# Altium schematic sheet Sheet4.SchDoc
size A3; DocumentNumber: 4; SheetNumber: 4; SheetTotal: 6
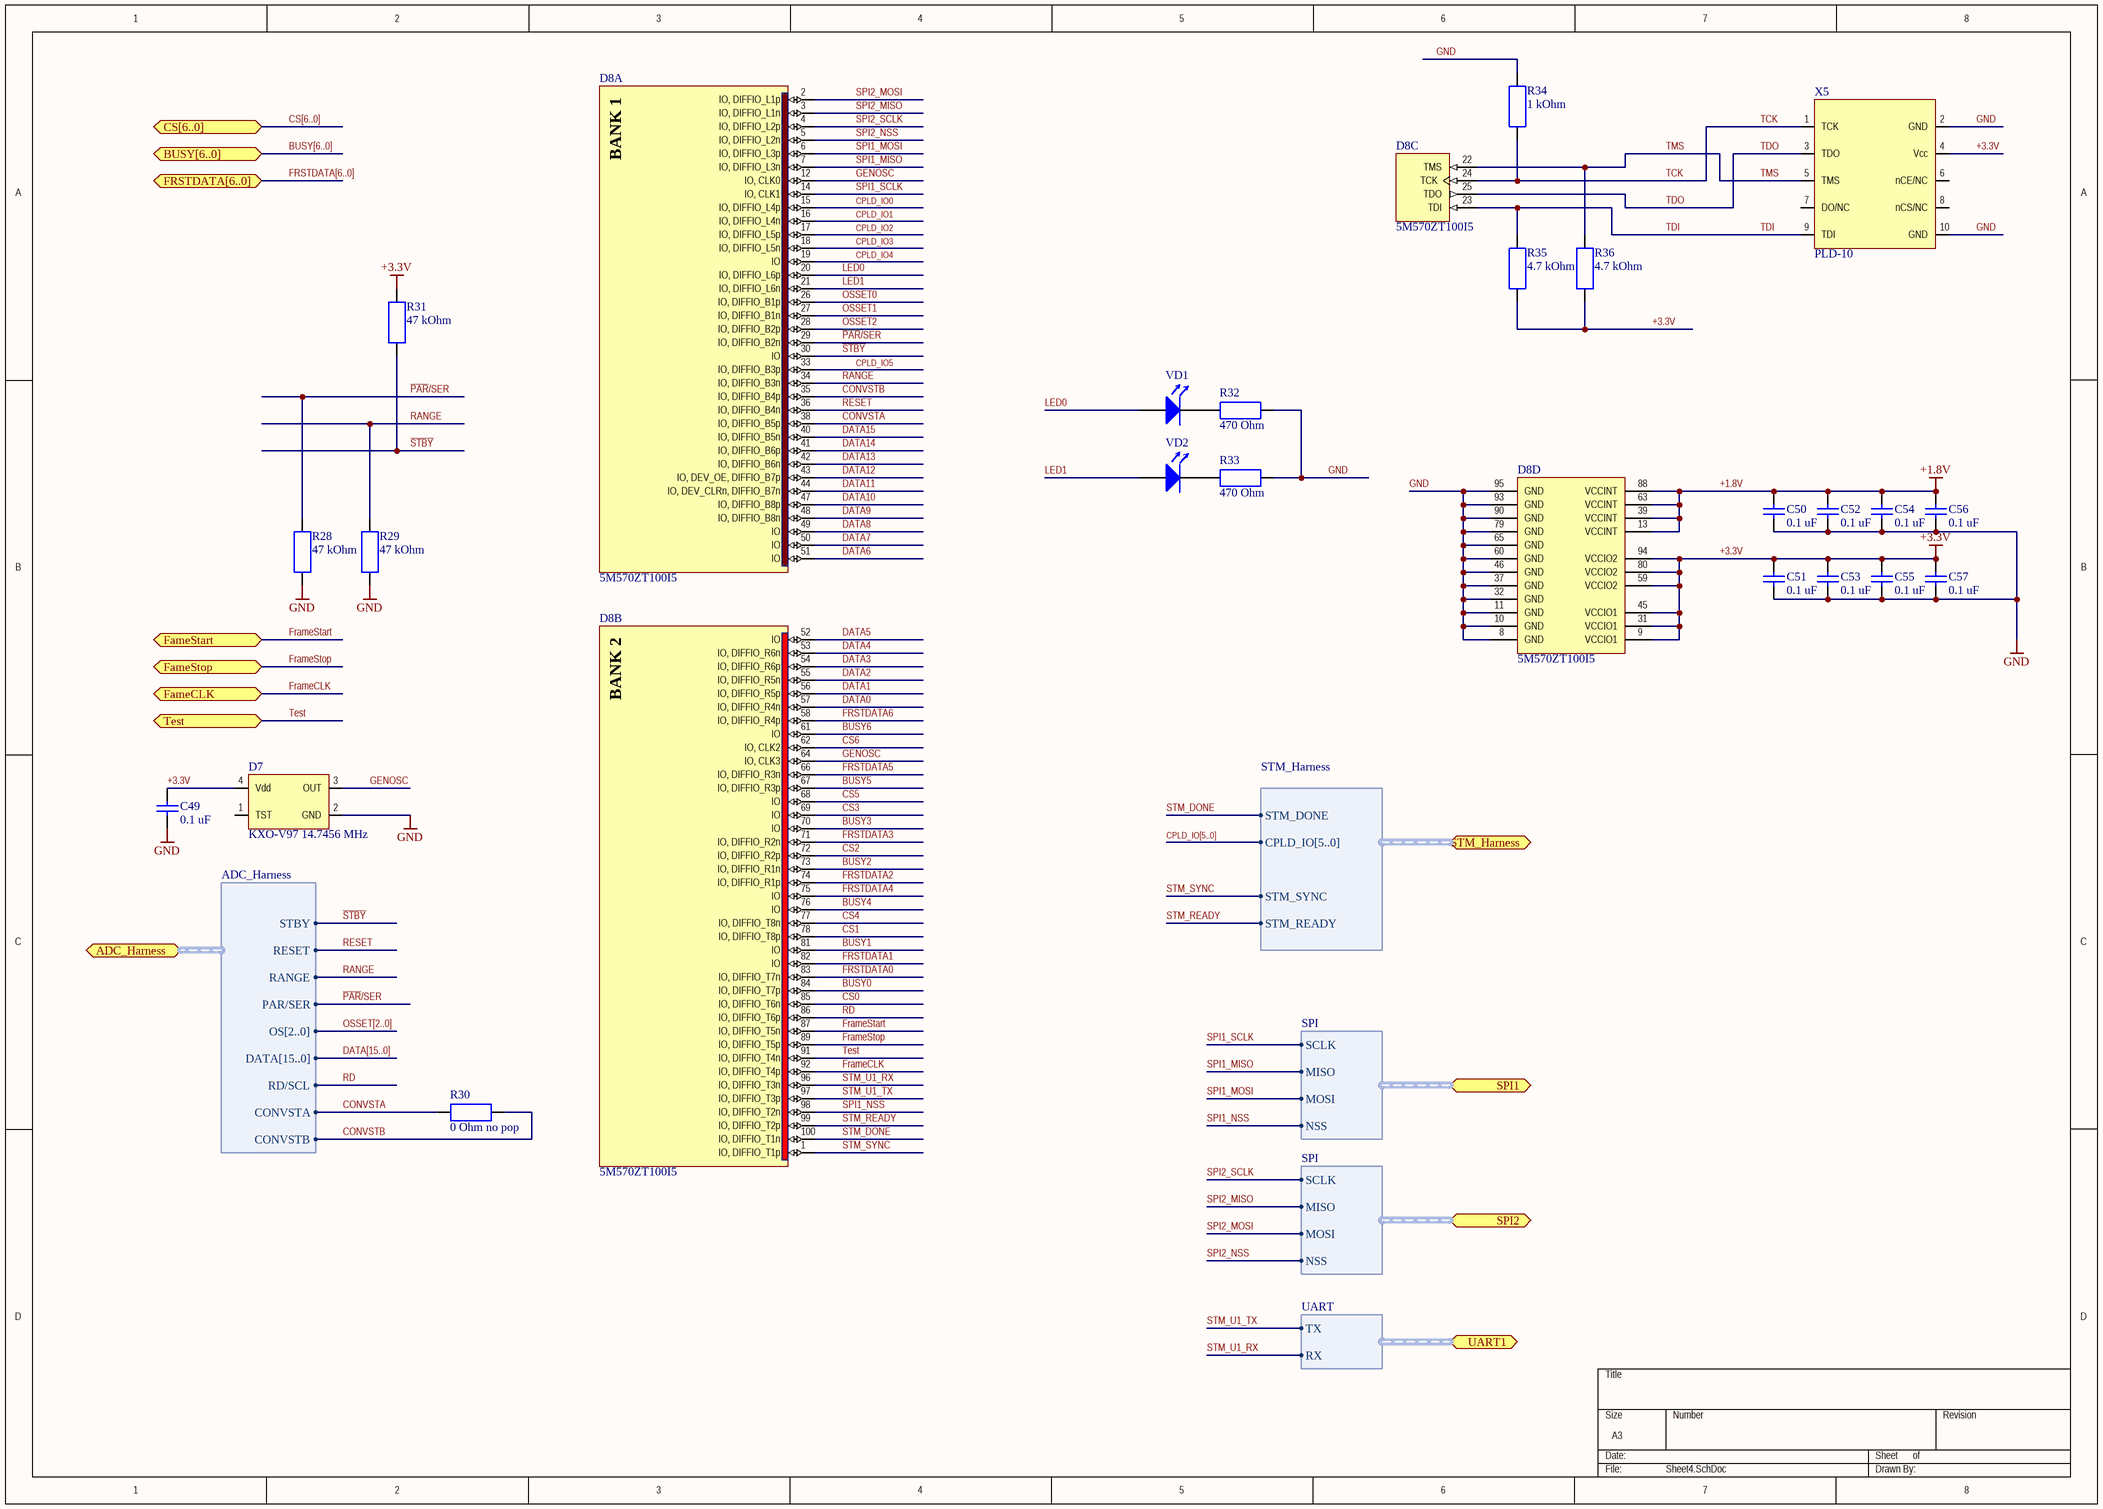
[diagram p0: Sheet4.SchDoc]

## Parts
C49  0.1 uF  [CAPC1608N]
C50  0.1 uF  [CAPC1608N]
C51  0.1 uF  [CAPC1608N]
C52  0.1 uF  [CAPC1608N]
C53  0.1 uF  [CAPC1608N]
C54  0.1 uF  [CAPC1608N]
C55  0.1 uF  [CAPC1608N]
C56  0.1 uF  [CAPC1608N]
C57  0.1 uF  [CAPC1608N]
D7  KXO-V97 14.7456 MHz  [KXO-V97]
D8  5M570ZT100I5  [TQFP100_A-120_L]  (parts A,B,C,D of 4)
R28  47 kOhm  [RESC1608N]
R29  47 kOhm  [RESC1608N]
R30  0 Ohm no pop  [RESC1608N]
R31  47 kOhm  [RESC1608N]
R32  470 Ohm  [RESC1608N]
R33  470 Ohm  [RESC1608N]
R34  1 kOhm  [RESC1608N]
R35  4.7 kOhm  [RESC1608N]
R36  4.7 kOhm  [RESC1608N]
VD1  KP-1608SURC  [LED1608N]  (value not drawn)
VD2  KP-1608SURC  [LED1608N]  (value not drawn)
X5  PLD-10  [PLD-10]

## Ports
ADC_Harness (harness ADC_Harness), BUSY[6..0], CS[6..0], FameCLK, FameStart, FameStop, FRSTDATA[6..0], SPI1 (harness SPI), SPI2 (harness SPI), STM_Harness (harness STM_Harness), Test, UART1 (harness UART)

## Harnesses
ADC_Harness: CONVSTA, CONVSTB, DATA[15..0], OS[2..0], PAR/SER, RANGE, RD/SCL, RESET, STBY
STM_Harness: STM_DONE, STM_SYNC, STM_READY, CPLD_IO[5..0]
SPI: NSS, MOSI, MISO, SCLK
UART: TX, RX

## Nets
+1.8V: C50.2 C52.2 C54.2 C56.2 D8.13(VCCINT) D8.39(VCCINT) D8.63(VCCINT) D8.88(VCCINT)
+3.3V: C49.2 C51.2 C53.2 C55.2 C57.2 D7.4(Vdd) D8.9(VCCIO1) D8.31(VCCIO1) D8.45(VCCIO1) D8.59(VCCIO2) D8.80(VCCIO2) D8.94(VCCIO2) R31.2 R35.2 R36.2 X5.4(Vcc)
GND: C49.1 C50.1 C51.1 C52.1 C53.1 C54.1 C55.1 C56.1 C57.1 D7.2(GND) D8.8(GND) D8.10(GND) D8.11(GND) D8.32(GND) D8.37(GND) D8.46(GND) D8.60(GND) D8.65(GND) D8.79(GND) D8.90(GND) D8.93(GND) D8.95(GND) R28.1 R29.1 R32.2 R33.2 R34.1 X5.2(GND) X5.10(GND)
BUSY0: D8.84(IO,_DIFFIO_T7p)
BUSY1: D8.81(IO)
BUSY2: D8.73(IO,_DIFFIO_R1n)
BUSY3: D8.70(IO)
BUSY4: D8.76(IO)
BUSY5: D8.67(IO,_DIFFIO_R3p)
BUSY6: D8.61(IO)
CONVSTA: D8.38(IO,_DIFFIO_B5p) R30.2 ; port ADC_Harness.CONVSTA
CONVSTB: D8.35(IO,_DIFFIO_B4p) R30.1 ; port ADC_Harness.CONVSTB
CPLD_IO0: D8.15(IO,_DIFFIO_L4p)
CPLD_IO1: D8.16(IO,_DIFFIO_L4n)
CPLD_IO2: D8.17(IO,_DIFFIO_L5p)
CPLD_IO3: D8.18(IO,_DIFFIO_L5n)
CPLD_IO4: D8.19(IO)
CPLD_IO5: D8.33(IO,_DIFFIO_B3p)
CS0: D8.85(IO,_DIFFIO_T6n)
CS1: D8.78(IO,_DIFFIO_T8p)
CS2: D8.72(IO,_DIFFIO_R2p)
CS3: D8.69(IO)
CS4: D8.77(IO,_DIFFIO_T8n)
CS5: D8.68(IO)
CS6: D8.62(IO,_CLK2)
DATA0: D8.57(IO,_DIFFIO_R4n)
DATA1: D8.56(IO,_DIFFIO_R5p)
DATA2: D8.55(IO,_DIFFIO_R5n)
DATA3: D8.54(IO,_DIFFIO_R6p)
DATA4: D8.53(IO,_DIFFIO_R6n)
DATA5: D8.52(IO)
DATA6: D8.51(IO)
DATA7: D8.50(IO)
DATA8: D8.49(IO)
DATA9: D8.48(IO,_DIFFIO_B8n)
DATA10: D8.47(IO,_DIFFIO_B8p)
DATA11: D8.44(IO,_DEV_CLRn,_DIFFIO_B7n)
DATA12: D8.43(IO,_DEV_OE,_DIFFIO_B7p)
DATA13: D8.42(IO,_DIFFIO_B6n)
DATA14: D8.41(IO,_DIFFIO_B6p)
DATA15: D8.40(IO,_DIFFIO_B5n)
FrameCLK: D8.92(IO,_DIFFIO_T4p) ; port FameCLK
FrameStart: D8.87(IO,_DIFFIO_T5n) ; port FameStart
FrameStop: D8.89(IO,_DIFFIO_T5p) ; port FameStop
FRSTDATA0: D8.83(IO,_DIFFIO_T7n)
FRSTDATA1: D8.82(IO)
FRSTDATA2: D8.74(IO,_DIFFIO_R1p)
FRSTDATA3: D8.71(IO,_DIFFIO_R2n)
FRSTDATA4: D8.75(IO)
FRSTDATA5: D8.66(IO,_DIFFIO_R3n)
FRSTDATA6: D8.58(IO,_DIFFIO_R4p)
GENOSC: D7.3(OUT) D8.12(IO,_CLK0) D8.64(IO,_CLK3)
LED0: D8.20(IO,_DIFFIO_L6p) VD1.1(A)
LED1: D8.21(IO,_DIFFIO_L6n) VD2.1(A)
OSSET0: D8.26(IO,_DIFFIO_B1p)
OSSET1: D8.27(IO,_DIFFIO_B1n)
OSSET2: D8.28(IO,_DIFFIO_B2p)
~{PAR}/SER: D8.29(IO,_DIFFIO_B2n) R28.2 ; port ADC_Harness.PAR/SER
RANGE: D8.34(IO,_DIFFIO_B3n) R29.2 ; port ADC_Harness.RANGE
RD: D8.86(IO,_DIFFIO_T6p) ; port ADC_Harness.RD/SCL
RESET: D8.36(IO,_DIFFIO_B4n) ; port ADC_Harness.RESET
~{STBY}: D8.30(IO) R31.1 ; port ADC_Harness.STBY
SPI1_MISO: D8.7(IO,_DIFFIO_L3n) ; port SPI1.MISO
SPI1_MOSI: D8.6(IO,_DIFFIO_L3p) ; port SPI1.MOSI
SPI1_NSS: D8.98(IO,_DIFFIO_T2n) ; port SPI1.NSS
SPI1_SCLK: D8.14(IO,_CLK1) ; port SPI1.SCLK
SPI2_MISO: D8.3(IO,_DIFFIO_L1n) ; port SPI2.MISO
SPI2_MOSI: D8.2(IO,_DIFFIO_L1p) ; port SPI2.MOSI
SPI2_NSS: D8.5(IO,_DIFFIO_L2n) ; port SPI2.NSS
SPI2_SCLK: D8.4(IO,_DIFFIO_L2p) ; port SPI2.SCLK
STM_DONE: D8.100(IO,_DIFFIO_T1n) ; port STM_Harness.STM_DONE
STM_READY: D8.99(IO,_DIFFIO_T2p) ; port STM_Harness.STM_READY
STM_SYNC: D8.1(IO,_DIFFIO_T1p) ; port STM_Harness.STM_SYNC
STM_U1_RX: D8.96(IO,_DIFFIO_T3n) ; port UART1.RX
STM_U1_TX: D8.97(IO,_DIFFIO_T3p) ; port UART1.TX
TCK: D8.24(TCK) R34.2 X5.1(TCK)
TDI: D8.23(TDI) R35.1 X5.9(TDI)
TDO: D8.25(TDO) X5.3(TDO)
Test: D8.91(IO,_DIFFIO_T4n) ; port Test
TMS: D8.22(TMS) R36.1 X5.5(TMS)
NetR32_1: R32.1 VD1.2(K)
NetR33_1: R33.1 VD2.2(K)

Not connected (* = marked no-connect by the designer): D7 1(TST); X5 6(nCE/NC) 7(DO/NC) 8(nCS/NC)

## Buses and harness runs
bus BUSY[6..0] = port BUSY[6..0]
bus CPLD_IO[5..0]
bus CS[6..0] = port CS[6..0]
bus DATA[15..0]
bus FRSTDATA[6..0] = port FRSTDATA[6..0]
bus OSSET[2..0]

## Notes on the sheet
- (in symbol 5M570ZT100I5, part A) BANK 1
- (in symbol 5M570ZT100I5, part B) BANK 2

## Library data of the parts
C49-C57 = CC0603: ±10%, X7R, 0603; MaxVoltage: 10Vdc; Value: 1µF; Published: 2014; LatestRevisionDate: 2014; LatestRevisionNote: Re-released for DXP Platform.; PackageReference: RAD-0.3; Publisher: DS; PackageDescription: ChipCapasitor; HelpURL: http://product.tdk.com/capacitor/mlcc/en/documents/mlcc_commercial_general_en.pdf; Supplier 1: Digi-Key; Supplier Part Number 1: 445-4998-1-ND
D8 = 5M570ZT100I5: MAX V 1.8V CPLD, 74 IOs, 570 Logic Elements, 100-Pin TQFP, Industrial Temperature, Speed Grade 5; DatasheetVersion: ver1.2, May-2011; PackageVersion: ver1.0, Jul-2011; PackageReference: TQFP100_A-120; PackageDescription: 100-Pin Plastic Thin Quad Flat Pack (TQFP) - Wire Bond - A:1.20; Code_JEDEC: MS-029-AED; ComponentLink1Description: Manufacturer URL; ComponentLink1URL: http://www.altera.com/; ComponentLink2Description: Datasheet; ComponentLink2URL: http://www.altera.com/literature/hb/max-v/max5_handbook.pdf; ComponentLink3Description: MAX V Device Pin-Out files; ComponentLink3URL: http://www.altera.com/literature/lit-dp.jsp?category=MAX%205&showspreadsheet=y; ComponentLink4Description: Package Specification; ComponentLink4URL: http://www.altera.com/devicepackaging/04R00365-01.pdf
R28-R36 = RES0603: ±5%, 0603; MaxVoltage: 10Vdc; Value: 1µF; Published: 2014; LatestRevisionDate: 2014; LatestRevisionNote: Re-released for DXP Platform.; PackageReference: RAD-0.3; Publisher: DS; PackageDescription: ChipCapasitor; HelpURL: http://product.tdk.com/capacitor/mlcc/en/documents/mlcc_commercial_general_en.pdf
X5 = BYTEBLASTER
VD1 VD2 = KP-1608SURC: Published: 29-Sep-2000; LatestRevisionDate: 17-Jul-2002; LatestRevisionNote: Re-released for DXP Platform.; PackageReference: 299-02; Publisher: Altium Limited; PackageDescription: Diode, Axial; Body 5.1 x 2.3 mm (LxDia. max), Lead Dia. 0.56 mm (max); Code_JEDEC: DO-204-AH; ComponentLink1Description: Manufacturer Link; ComponentLink1URL: http://www.onsemi.com/site/products/landing?taxonomyID=194